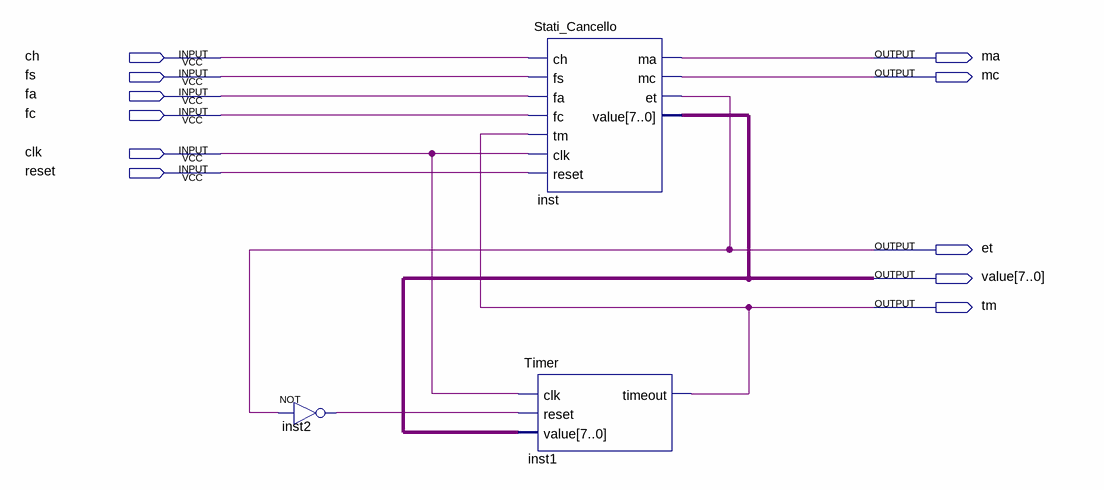
[diagram p0: schematic sheet]
// Quartus schematic ApricancelloVHDL.bdf as structural Verilog: 3 symbols, 11 pins
module ApricancelloVHDL (
  input  ch,
  input  fs,
  input  fa,
  input  fc,
  input  clk,
  input  reset,
  output ma,
  output mc,
  output et,
  output [7:0] value,
  output tm
);

  wire inst2_out;

  not inst2 (inst2_out, et);
  Stati_Cancello inst (
    .ch(ch), .fs(fs), .fa(fa), .fc(fc), .tm(tm), .clk(clk), .reset(reset), .ma(ma), .mc(mc), .et(et),
    .value(value));
  Timer inst1 (.clk(clk), .reset(inst2_out), .value(value), .timeout(tm));
endmodule
